# Altium schematic sheet LOADCELL.SchDoc
size A3; SheetNumber: 2; SheetTotal: 2
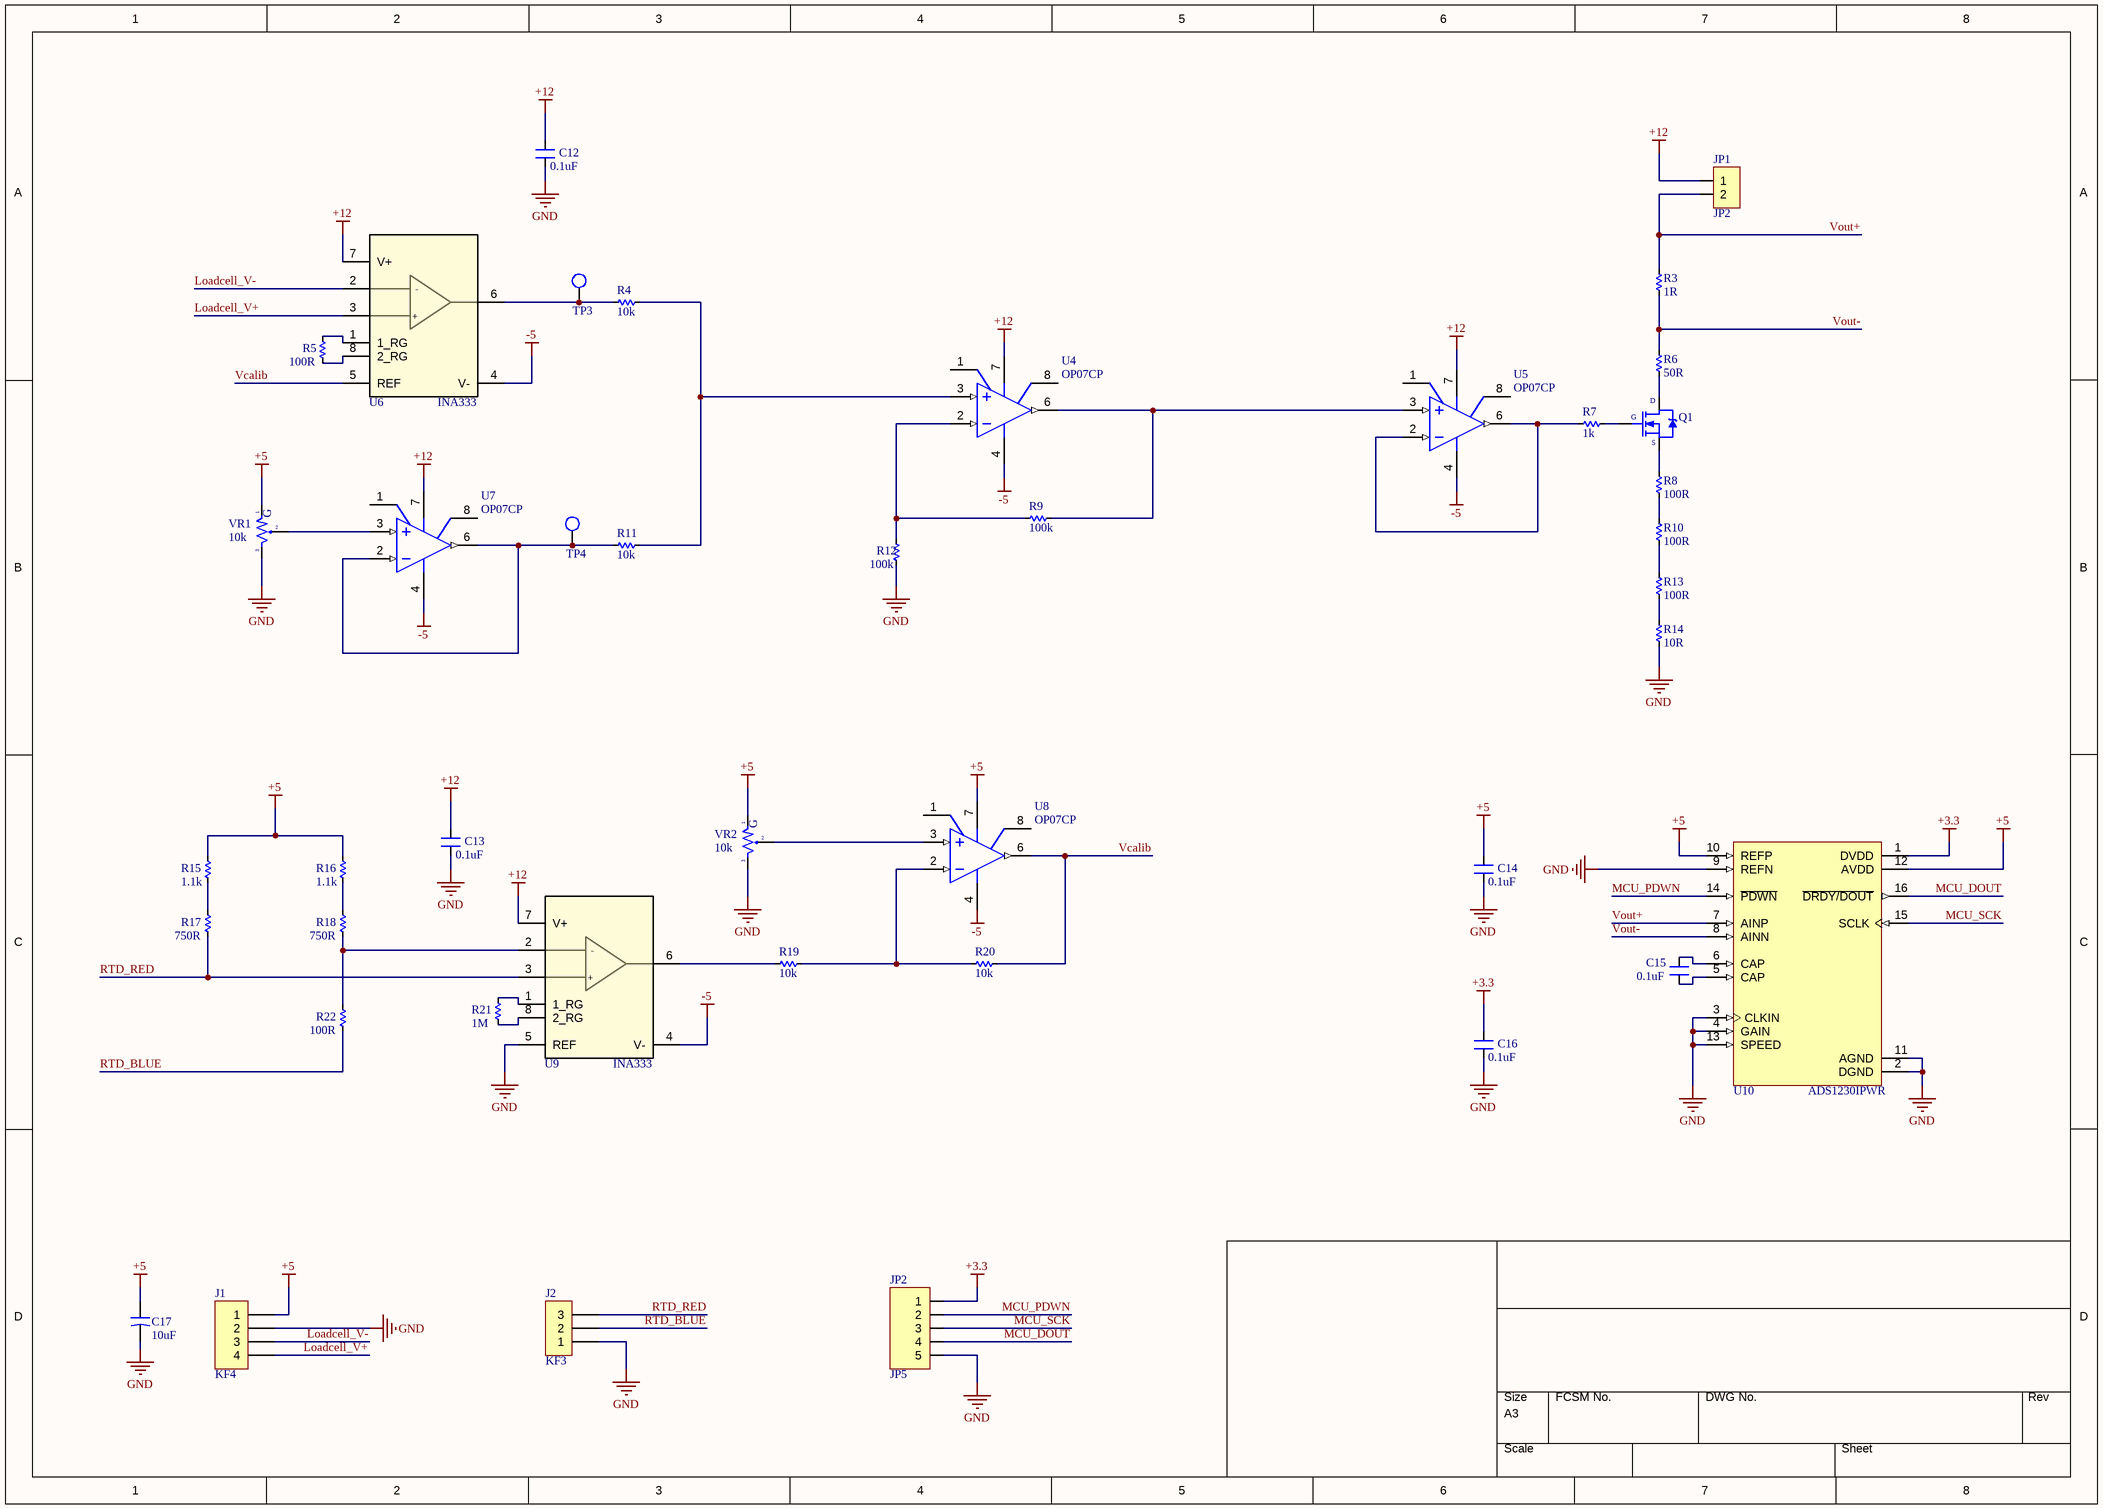
[diagram p0: LOADCELL.SchDoc]

## Parts
C12  0.1uF  [CN-SMD-0603]
C13  0.1uF  [CN-SMD-0603]
C14  0.1uF  [CN-SMD-0603]
C15  0.1uF  [CN-SMD-0603]
C16  0.1uF  [CN-SMD-0603]
C17  10uF  [CAP-ALU-SMD-4.5x5x1.4]
J1  KF4  [KF4-5.08T]
J2  KF3  [KF3-5.08T]
JP1  JP2  [JP2-CLOSED]
JP2  JP5  [JP5-D1T]
Q1  AO3400  [SOT23-123]  (value not drawn)
R3  1R  [RES-SMD-0603]
R4  10k  [RES-SMD-0603]
R5  100R  [RES-SMD-0603]
R6  50R  [RES-SMD-0603]
R7  1k  [RES-SMD-0603]
R8  100R  [RES-SMD-0603]
R9  100k  [RES-SMD-0603]
R10  100R  [RES-SMD-0603]
R11  10k  [RES-SMD-0603]
R12  100k  [RES-SMD-0603]
R13  100R  [RES-SMD-0603]
R14  10R  [RES-SMD-0603]
R15  1.1k  [RES-SMD-0603]
R16  1.1k  [RES-SMD-0603]
R17  750R  [RES-SMD-0603]
R18  750R  [RES-SMD-0603]
R19  10k  [RES-SMD-0603]
R20  10k  [RES-SMD-0603]
R21  1M  [RES-SMD-0603]
R22  100R  [RES-SMD-0603]
TP3  Test-Point  [TESTPOINT]  (value not drawn)
TP4  Test-Point  [TESTPOINT]  (value not drawn)
U4  OP07CP  [SO8]
U5  OP07CP  [SO8]
U6  INA333  [VSSOP8]
U7  OP07CP  [SO8]
U8  OP07CP  [SO8]
U9  INA333  [VSSOP8]
U10  ADS1230IPWR  [TSSOP16]
VR1  10k  [VR-S2]
VR2  10k  [VR-S2]

## Nets
+3.3: C16.1 JP2.1 U10.1(DVDD)
+5: C14.1 C17.1 J1.1 R15.1 R16.1 U8.7(V+) U10.10(REFP) U10.12(AVDD) VR1.1 VR2.1
+12: C12.1 C13.1 JP1.1 U4.7(V+) U5.7(V+) U6.7(V+) U7.7(V+) U9.7(V+)
-5: U4.4(V-) U5.4(V-) U6.4(V-) U7.4(V-) U8.4(V-) U9.4(V-)
GND: C12.2 C13.2 C14.2 C16.2 C17.2 J1.2 J2.1 JP2.5 R12.2 R14.1 U9.5(REF) U10.2(DGND) U10.3(CLKIN) U10.4(GAIN) U10.9(REFN) U10.11(AGND) U10.13(SPEED) VR1.3 VR2.3
Loadcell_V+: J1.4 U6.3(VIN+)
Loadcell_V-: J1.3 U6.2(VIN-)
MCU_DOUT: JP2.4 U10.16(~{DRDY/DOUT})
MCU_PDWN: JP2.2 U10.14(~{PDWN})
MCU_SCK: JP2.3 U10.15(SCLK)
RTD_BLUE: J2.2 R22.2
RTD_RED: J2.3 R17.2 U9.3(VIN+)
Vcalib: R20.2 U6.5(REF) U8.6(OUT)
Vout+: JP1.2 R3.2 U10.7(AINP)
Vout-: R3.1 R6.2 U10.8(AINN)
NetC15_1: C15.1 U10.6(CAP)
NetC15_2: C15.2 U10.5(CAP)
NetQ1_1: Q1.1(G) R7.2
NetQ1_2: Q1.2(D) R6.1
NetQ1_3: Q1.3(S) R8.2
NetR4_1: R4.1 TP3.1 U6.6(VOUT)
NetR4_2: R4.2 R11.2 U4.3(IN+)
NetR5_1: R5.1 U6.1(1_RG)
NetR5_2: R5.2 U6.8(2_RG)
NetR7_1: R7.1 U5.2(IN-) U5.6(OUT)
NetR8_1: R8.1 R10.2
NetR9_1: R9.1 R12.1 U4.2(IN-)
NetR9_2: R9.2 U4.6(OUT) U5.3(IN+)
NetR10_1: R10.1 R13.2
NetR11_1: R11.1 TP4.1 U7.2(IN-) U7.6(OUT)
NetR13_1: R13.1 R14.2
NetR15_2: R15.2 R17.1
NetR16_2: R16.2 R18.1
NetR18_2: R18.2 R22.1 U9.2(VIN-)
NetR19_1: R19.1 U9.6(VOUT)
NetR19_2: R19.2 R20.1 U8.2(IN-)
NetR21_1: R21.1 U9.1(1_RG)
NetR21_2: R21.2 U9.8(2_RG)
NetU7_3: U7.3(IN+) VR1.2
NetU8_3: U8.3(IN+) VR2.2

Not connected (* = marked no-connect by the designer): U4 1(VOSTRIM) 8(VOSTRIM); U5 1(VOSTRIM) 8(VOSTRIM); U7 1(VOSTRIM) 8(VOSTRIM); U8 1(VOSTRIM) 8(VOSTRIM)

## Notes on the sheet
- Project:
- Sheet title:
- BAO BUI Q.
- SAMY VE & VY TRAN
- A3
- Sheet
- Checked by:
- of
- Revision:
- Designed by:
- Size:
- Date:
- (in symbol INA333) -; +
- (in symbol VR-S) G

## Library data of the parts
C12-C16 = CN: Value: 33pF
C17 = CN-SMD: Polarized Capacitor (Axial); Published: 8-Jun-2000; LatestRevisionDate: 17-Jul-2002; LatestRevisionNote: Re-released for DXP Platform.; PackageReference: POLAR0.8; Publisher: Altium Limited
J1 = KF4: Manufacturer: W¨¹rth Elektronik eiSos GmbH; PartNo: 691133710004; ComponentLink1 Description: Manufacturer; ComponentLink2 Description: Datasheet; NoPins: 4; ComponentLink1 URL: http://www.we-online.com; ComponentLink2 URL: http://katalog.we-online.de/em/datasheet/6911337100xx.pdf; Created By: Baojun Chen; Created Date: 4-Aug-15
J2 = KF3: Manufacturer: Würth Elektronik eiSos GmbH; partNo: 691103110003; ComponentLink1 Description: Manufacturer; ComponentLink2 Description: Datasheet; NoPins: 3; Created Date: 29 October 2013; ComponentLink1URL: http://www.we-online.com; ComponentLink2URL: http://katalog.we-online.de/em/datasheet/6911031100xx.pdf; Created by: Karrer Zheng
JP1 = JP2: WR-PHD 2.54 mm Angled Socket Header; Manufacturer: W¨¹rth Elektronik eiSos GmbH; partNo: 613002143121; ComponentLink1 Description: Manufacturer; ComponentLink2 Description: Datasheet; NoPins: 02; Created Date: 29 March 2013; ComponentLink1URL: http://www.we-online.com; ComponentLink2URL: http://katalog.we-online.de/em/datasheet/6130xx143121.pdf; Created by: Karrer Zheng
JP2 = JP5: WR-PHD 2.54 mm Angled Socket Header; Manufacturer: W¨¹rth Elektronik eiSos GmbH; partNo: 613005143121; ComponentLink1 Description: Manufacturer; ComponentLink2 Description: Datasheet; NoPins: 05; Created Date: 29 March 2013; ComponentLink1URL: http://www.we-online.com; ComponentLink2URL: http://katalog.we-online.de/em/datasheet/6130xx143121.pdf; Created by: Karrer Zheng
Q1 = AO3400: N-MOS 30V 5.8A
R3-R22 = Res-SMD: Resistor; Manufacturer: Generic Components; Class: Passive; Published: 08/06/2000; Publisher: Altium Hobart Technology Centre
U4 U5 U7 U8 = OP07CP: Ultra-Low Offset Voltage Operational Amplifier; Note: Pin 5 is not connected.; Published: 8-Jun-2000; LatestRevisionDate: 04-Mar-2005; LatestRevisionNote: Stylized 3D Model Added.; DatasheetVersion: 1992; PackageReference: N-8_A; Publisher: Altium Limited; PackageDescription: DIP; 8 Leads; Row Spacing 7.62 mm; Pitch 2.54 mm; Code_JEDEC: MO-001-AN; ComponentLink1Description: Manufacturer Link; ComponentLink1URL: http://www.analog.com/en/prod/0,,759_786_OP07%2C00.html; ComponentLink2Description: Datasheet; ComponentLink2URL: http://www.analog.com/UploadedFiles/Data_Sheets/39161232478959OP07_c.pdf
VR1 VR2 = VR-S: Var Resistor; Value: Volume 50k